# Altium schematic sheet Output-Connectors.SchDoc
size A; SheetNumber: 3; SheetTotal: 3
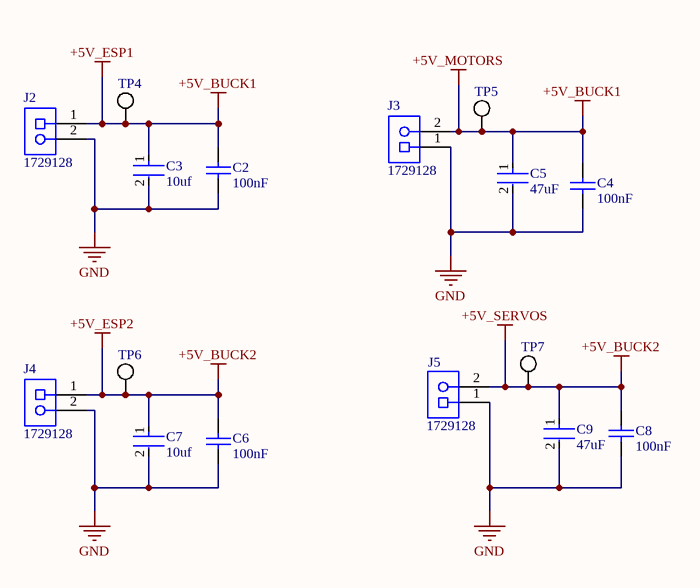
[diagram p0: Output-Connectors.SchDoc]

## Parts
C2  100nF  [CAPC1206(3216)170_L]
C3  10uf  [FP-GCJ31C-0_3-IPC_C]
C4  100nF  [CAPC1206(3216)170_L]
C5  47uF  [FP-1210-L_3_2_0_3-W_2_5_0-IPC_B]
C6  100nF  [CAPC1206(3216)170_L]
C7  10uf  [FP-GCJ31C-0_3-IPC_C]
C8  100nF  [CAPC1206(3216)170_L]
C9  47uF  [FP-1210-L_3_2_0_3-W_2_5_0-IPC_B]
J2  1729128  [PHOE-1729128-2_V]
J3  1729128  [PHOE-1729128-2_V]
J4  1729128  [PHOE-1729128-2_V]
J5  1729128  [PHOE-1729128-2_V]
TP4  Test Point  [Test Point]  (value not drawn)
TP5  Test Point  [Test Point]  (value not drawn)
TP6  Test Point  [Test Point]  (value not drawn)
TP7  Test Point  [Test Point]  (value not drawn)

## Nets
+5V_BUCK1: C2.2 C3.1 C4.2 C5.1 J2.1 J3.2 TP4.1 TP5.1  [also labelled +5V_ESP1, +5V_MOTORS]
+5V_BUCK2: C6.2 C7.1 C8.2 C9.1 J4.1 J5.2 TP6.1 TP7.1  [also labelled +5V_ESP2, +5V_SERVOS]
GND: C2.1 C3.2 C4.1 C5.2 C6.1 C7.2 C8.1 C9.2 J2.2 J3.1 J4.2 J5.1

## Library data of the parts
C2 C4 C6 C8 = CMP-1037-04201-1: CAP 100nF 50V ±10% 1206 (3216 Metric) Thickness 1.7mm SMD; Case-Metric: 3216; Tolerance: Â±10%; Case-EIA: 1206; Value: 100nF; Max Thickness: 1.7 mm; Rated Voltage: 50 V; Technology: SMT
C3 C7 = CMP-06035-052008-1: Cap Ceramic 10uF 10V X7R 10% Pad SMD 1206 Soft Termination  +125°C Automotive T/R; Min Operating Temperature: -55°C; Package Quantity: 2000; Voltage Rating: 10V; Voltage Rating (DC): 10V; Features: Soft Termination; Tolerance: 10%; Max Operating Temperature: 125°C; Length: 3.2mm; Case/Package: 1206; Dielectric: X7R; Thickness: 0.063inch; Case Code (Metric): 3216; Lead Free: Lead Free; Height: 1.6mm; Packaging: Tape and Reel; Case Code (Imperial): 1206; Ratings: AEC-Q200; Voltage: 10V; Width: 0.063inch; Capacitance: 10uF; Mount: Surface Mount; Depth: 1.6mm; Termination: SMD/SMT
C5 C9 = CMP-14477-000081-1: Capacitor Ceramic Multilayer 47uF 10% 10V X7R SMD 1210; Packaging: Tape and Reel; Width: 0.098inch; Case/Package: 1210; Mount: Surface Mount; Thickness: 0.106inch; RoHS Compliant: Yes; Voltage Rating: 10V; Capacitance: 47uF; Tolerance: 10%; Max Operating Temperature: 125°C; Length: 0.126inch; Min Operating Temperature: -55°C
J2-J5 = CMP-2000-05815-1: PCB Terminal Block, 13.5 A, 400 V, 2-Pin THD, RoHS, Bulk; Manufacturer: Phoenix Contact; Package Version: 03/2015; No. of Rows: 1; Pitch: 5.08mm; No. of Positions: 2; Voltage Rating: 400V; Current Rating: 13500mA; Manufacturer URL: http://www.phoenixcontact.com/; Datasheet URL: https://datasheet.ciiva.com/16046/1729128-16046181.pdf; RoHS: TRUE; Package URL: https://www.phoenixcontact.com/online/portal/pi/pxc/product_detail_page/!ut/p/b1/3VdJjqNKFDxLH8AFycySyWY2ozFsEPOMMQaDOX1XedGL_1Vdm5YXJleknhSKeBkvI6EA8ncAo3AYoDhBQGco6KN7VURTdemj9us_IEKEZo_YHiPAEWEFmDGOHMORkqKYCORBZxgL7ZoaZYcbFFUZ3fqxSY6GOuxydWUuHqz1ynmMFygu583Bob0Ewr6Sd_l-5m-kAueHiB0jpRwZwe58wwtkpxtMYd_LmGcDRU02dRNEyWt6Y2ti5pSyJ_reIkzIulrqApdnbT11V5jnCKbYNCvhEM1MCpPByat_X379-iThf08CI5GfOPqfBeS3BRoBOdD55AKVv0iLwCMq-2BrzXWSGRH7pUGD9uwXQjiph3xL0DKQwdGa0JImiIOmBNOestqgwTHSSs2oOep-78apyXQBvNi8ZLaFjvjWvcaUEBu0MC6Wbe-d6mB0FAebo2lUWinqYaZs5DAYzV0RP9yitUjnGJ0iI9xhZkT42OCQNUJJhkgWINNQLP2JFP6OpMg3JCVg70jqHT0lvKOnhHf0lPuOnnLf0VPuWx6_dxwUIvwk5WMkT0kLL1mh61l2yZVSzG3pYV_bqo-mj6uMKwKwdnnW8Jh5RTOJzMOA5c-eJDaZQw4mTMPH02PvS_ZAqNVjVTo2WyYLkwH_KU1mmmG5kjRhDqPXLwwVHvVOjCM60-fpXvTDfMGW1PVFVS1r4e4yVDk4ZdNbkUHvqPqQSeian4UD39fNKmachqdJ1NJbyk8rXT9mXTvPk3oE5meulKGgiruPJek-4I9hTT6G8ZLOyRSm2RRVbThERQad5OS28hdt4YW4vG0stgYYzsWsK4_7y6DZMjJSCqri1kyiZR5vD7pwIrNR7QwPHTcLTI5qT7eRlpHrdGiupYlqQDJ7zy_CND8fWWBoLRXxk1RVcXiBQwbTD4Xi7KL-FuO94t9xaqweXzH; PartNumber: 1729128; Package Description: 2-Pin Through Hole Device, Body 8.1 x 10.16 mm, Pitch 5.08 mm; Datasheet Version: 12/2013; Mounting Technology: ThroughHole; Orientation: Horizontal; Package Reference: 1729128-2; Packing: Bulk
TP4-TP7 = CMP-00030-00006-7